# Altium schematic sheet PowerCircuit.SchDoc
size A
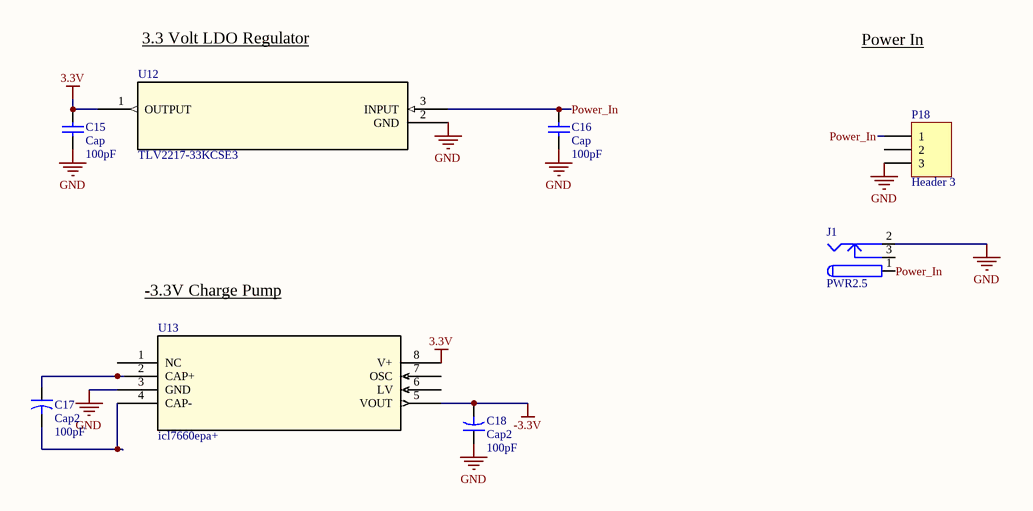
[diagram p0: PowerCircuit.SchDoc]

## Parts
C15  Cap  value 100pF  [RAD-0.3]
C16  Cap  value 100pF  [RAD-0.3]
C17  Cap2  value 100pF  [CAPR5-4X5]
C18  Cap2  value 100pF  [CAPR5-4X5]
J1  PWR2.5  [Power 2.5 fixed]
P18  Header 3  [HDR1X3]
U12  TLV2217-33KCSE3  [KCS3]
U13  icl7660epa+  [21-0043D_8_MXM]

## Nets
3.3V: C15.1 U12.1(OUTPUT) U13.8(V+)
-3.3V: C18.2 U13.5(VOUT)
GND: C15.2 C16.2 C18.1 J1.2(2A) P18.3 U12.2(GND) U13.3(GND)
Power_In: C16.1 J1.1(1A) P18.1 U12.3(INPUT)
NetC17_1: C17.1 U13.2(CAP+)
NetC17_2: C17.2 U13.4(CAP-)

Not connected (* = marked no-connect by the designer): J1 3(3A); P18 2; U13 1(NC) 6(LV) 7(OSC)

## Notes on the sheet
- Power In
- 3.3 Volt LDO Regulator
- -3.3V Charge Pump

## Library data of the parts
C15 C16 = Cap: Capacitor; Published: 8-Jun-2000; LatestRevisionDate: 17-Jul-2002; LatestRevisionNote: Re-released for DXP Platform.; PackageReference: RAD-0.3; Publisher: Altium Limited; PackageDescription: Radial Cap, Thru-Hole; 2 Leads; 0.3 in Pin Spacing
C17 C18 = Cap2: Capacitor; Published: 23-Sep-2002; PackageReference: CAPR5-4X5; Publisher: Altium Limited; PackageDescription: Capacitor; 2 Leads
J1 = PWR2.5: Low Voltage Power Supply Connector; Published: 17-Dec-2003; DatasheetDocument: 09-May-2002; Publisher: Altium Limited; ComponentLink1Description: Manufacturer Link; ComponentLink1URL: http://domino.kycon.com/internet/Products.html
P18 = Header 3: Header, 3-Pin; LatestRevisionDate: 17-Jul-2002; LatestRevisionNote: Re-released for DXP Platform.; Publisher: Altium Limited
U12 = TLV2217-33KCSE3: Single Output LDO, 500mA, Fixed(1.8V), Output Accuracy of 2%, Thermal Overload Protection; GENERIC_PART_NUMBER: TLV2217-18; Vendor: Texas Instruments; PACKAGE_DESIGNATOR: KCS; PIN_COUNT: 3; FAMILY_NAME: SINGLE CHANNEL LDO; INDUSTRY_STD_PKG_TYPE: TO-220; Manufacturer_Part_Number: TLV2217-33KCSE3; Datasheet_URL: http://www.ti.com/lit/gpn/TLV2217-18; Manufacturer: Texas Instruments; Copyright: Copyright (C) 2018 Accelerated Designs. All rights reserved; RefDes: RefDes; Type: DEV
U13 = icl7660epa+: No Description Available; Vendor: Maxim Integrated Products; Built_By: EMA_UL_Team; SourceLibrary: Maxim_2014-06-20; Manufacturer_Part_Number: icl7660epa+; Copyright: Copyright (C) 2018 Accelerated Designs. All rights reserved; RefDes: RefDes; Type: DEV